# EAGLE design arduino_mega_2 (EAGLE 6.2)
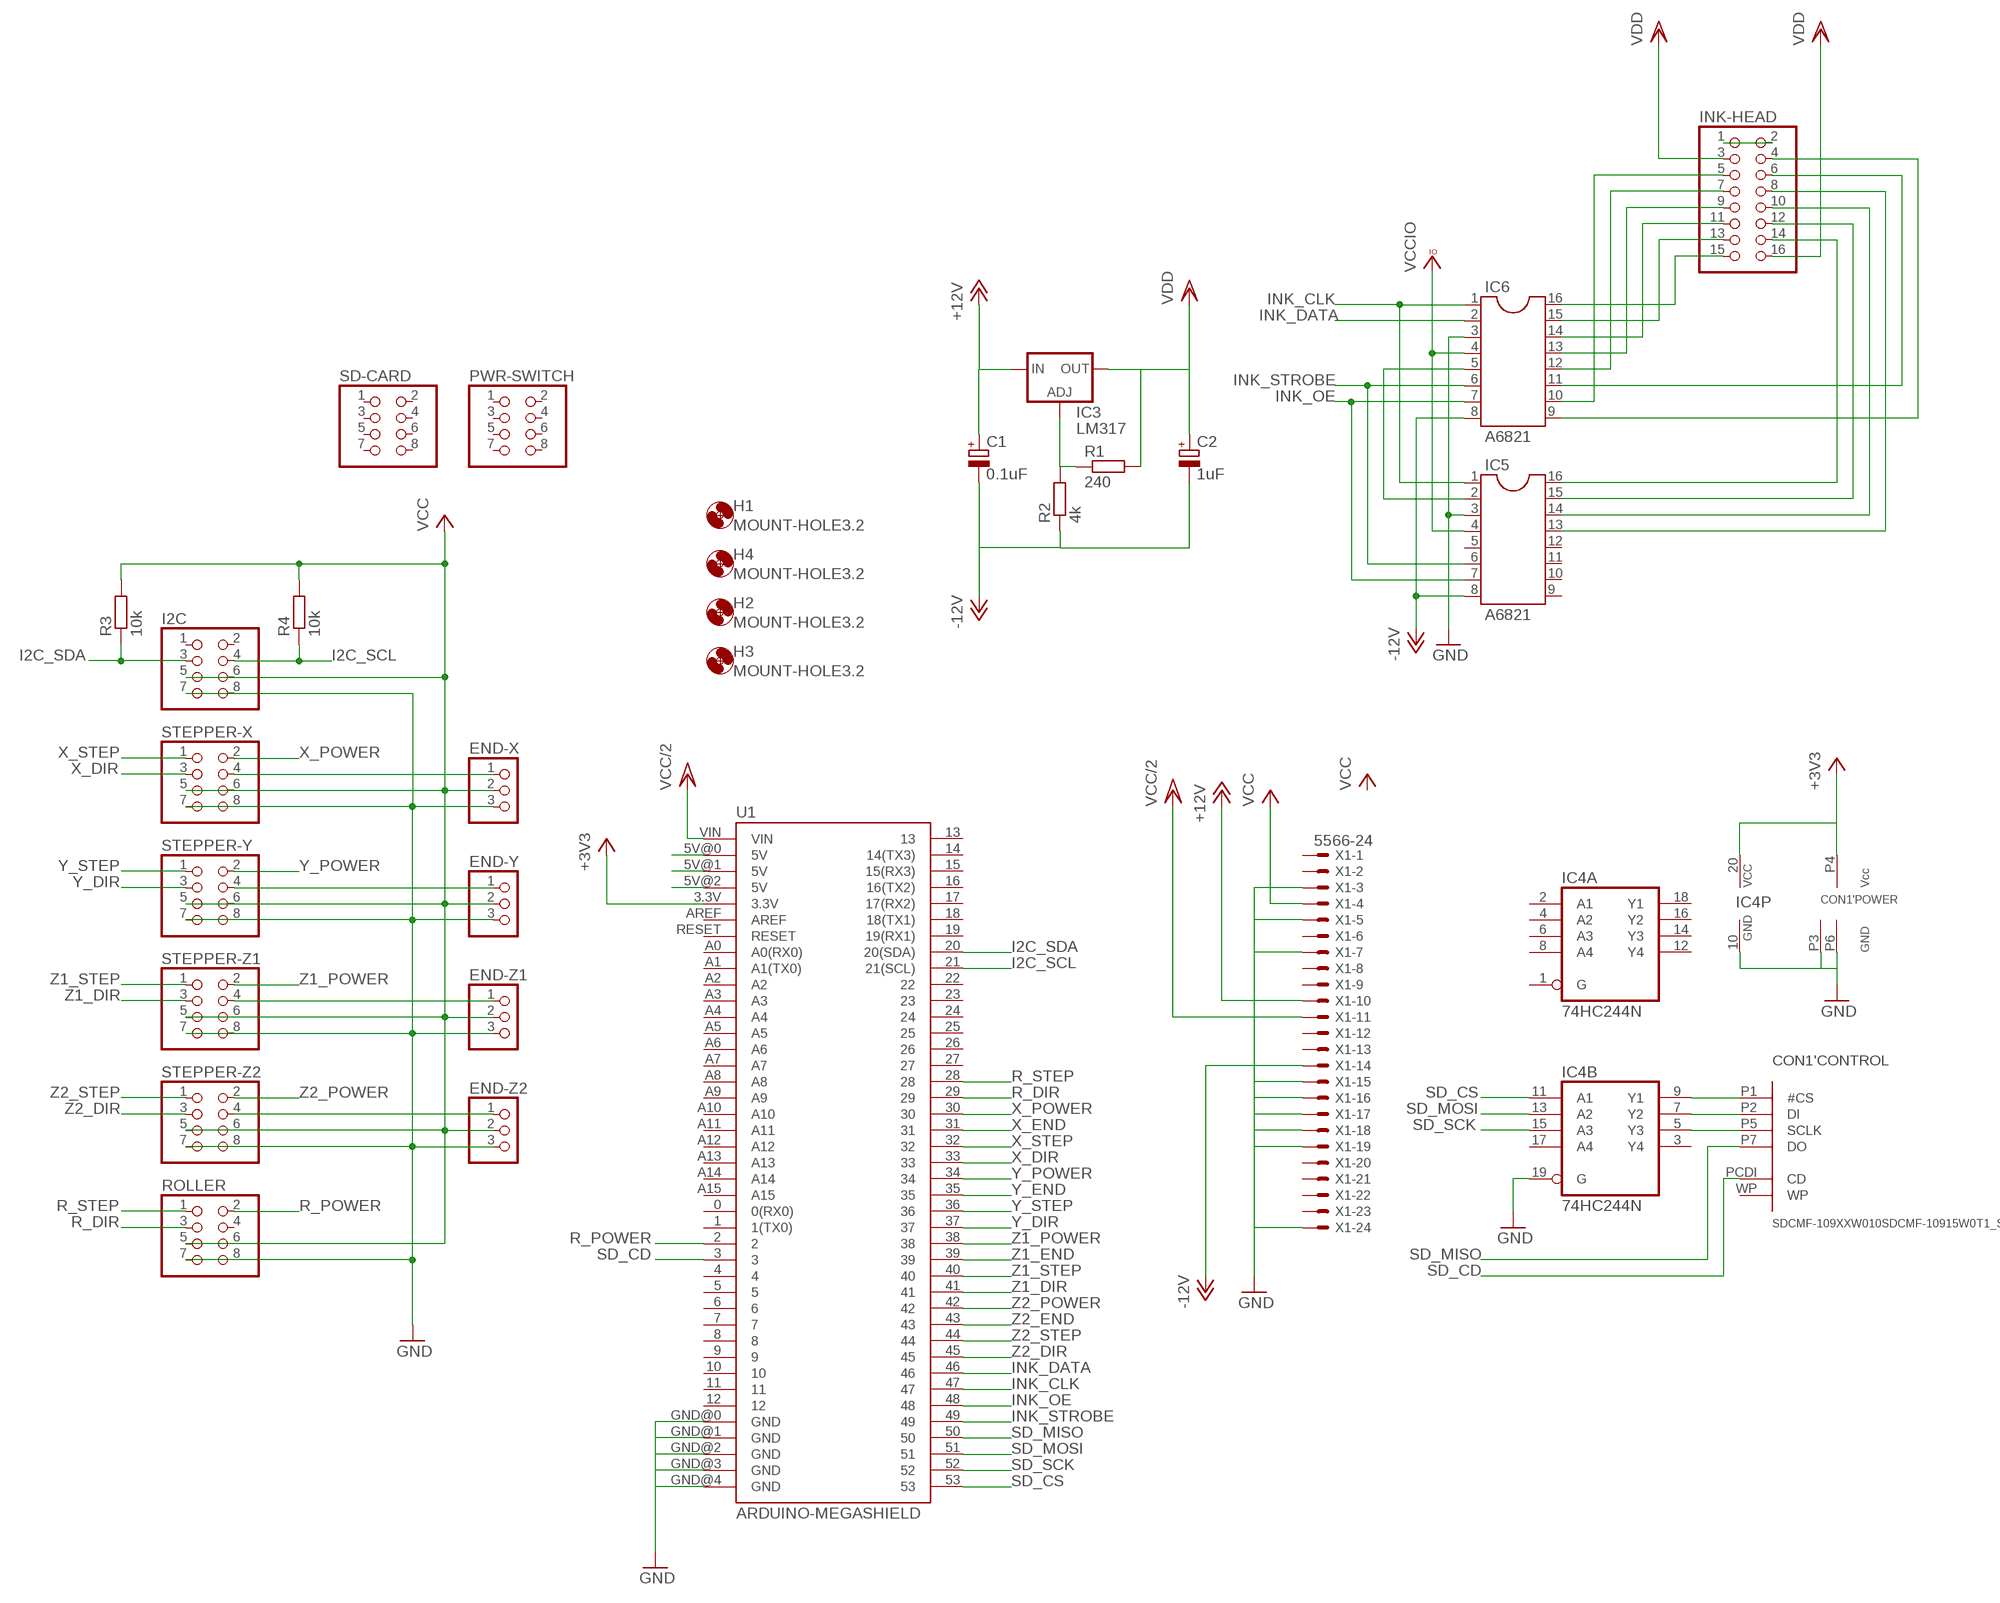
[diagram p0: schematic, sheet 1]

## Parts
C1  0.1uF  CPOL-EUE2-5  [E2-5]
C2  1uF  CPOL-EUE2-5  [E2-5]
CON1  SDCMF-109XXW010SDCMF-10915W0T1_SO  [SDCMF-10915W0T1]
END-X  PINHD-1X3  [1X03]
END-Y  PINHD-1X3  [1X03]
END-Z1  PINHD-1X3  [1X03]
END-Z2  PINHD-1X3  [1X03]
H1  MOUNT-HOLE3.2  [3,2]
H2  MOUNT-HOLE3.2  [3,2]
H3  MOUNT-HOLE3.2  [3,2]
H4  MOUNT-HOLE3.2  [3,2]
I2C  PINHD-2X4  [2X04]
IC3  LM317  LM317TL  [317TL]
IC4  74HC244N  [DIL20]
IC5  A6821  DIL16  [DIL16]
IC6  A6821  DIL16  [DIL16]
INK-HEAD  PINHD-2X8  [2X08]
PWR-SWITCH  PINHD-2X4  [2X04]
R1  240  R-EU_0207/10  [0207/10]
R2  4k  R-EU_0207/10  [0207/10]
R3  10k  R-EU_0204/7  [0204/7]
R4  10k  R-EU_0204/7  [0204/7]
ROLLER  PINHD-2X4  [2X04]
SD-CARD  PINHD-2X4  [2X04]
STEPPER-X  PINHD-2X4  [2X04]
STEPPER-Y  PINHD-2X4  [2X04]
STEPPER-Z1  PINHD-2X4  [2X04]
STEPPER-Z2  PINHD-2X4  [2X04]
U1  ARDUINO-MEGASHIELD  [ARDUINO_MEGA_SHIELD]
X1  5566-24  [5566-24]

## Nets
+3V3: CON1.P4('POWER:VCC) IC4.20(P:VCC) U1.3.3V
+12V: C1.+ IC3.3(IN) X1.10
-12V: C1.- C2.- IC5.8 IC6.8 R2.1 X1.14
GND: CON1.P3('POWER:GND) CON1.P6('POWER:GND) END-X.3 END-Y.3 END-Z1.3 END-Z2.3 I2C.7 I2C.8 IC4.10(P:GND) IC4.19(B:G) IC5.3 IC6.3 ROLLER.7 ROLLER.8 STEPPER-X.7 STEPPER-X.8 STEPPER-Y.7 STEPPER-Y.8 STEPPER-Z1.7 STEPPER-Z1.8 STEPPER-Z2.7 STEPPER-Z2.8 U1.GND@0(GND) U1.GND@1(GND) U1.GND@2(GND) U1.GND@3(GND) U1.GND@4(GND) X1.3 X1.5 X1.7 X1.15 X1.16 X1.17 X1.18 X1.19 X1.24
I2C_SCL: I2C.4 R4.1 U1.21(21(SCL))
I2C_SDA: I2C.3 R3.1 U1.20(20(SDA))
INK_CLK: IC5.1 IC6.1 U1.47
INK_DATA: IC6.2 U1.46
INK_OE: IC5.7 IC6.7 U1.48
INK_STROBE: IC5.6 IC6.6 U1.49
N$1: CON1.P1('CONTROL:#CS) IC4.9(B:Y1)
N$2: CON1.P5('CONTROL:SCLK) IC4.5(B:Y3)
N$3: CON1.P2('CONTROL:DI) IC4.7(B:Y2)
N$4: INK-HEAD.1 INK-HEAD.2
N$5: IC5.16 INK-HEAD.14
N$6: IC5.15 INK-HEAD.12
N$7: IC5.14 INK-HEAD.10
N$8: IC5.13 INK-HEAD.8
N$9: IC6.11 INK-HEAD.6
N$10: IC6.9 INK-HEAD.4
N$11: IC6.16 INK-HEAD.15
N$12: IC6.15 INK-HEAD.13
N$13: IC6.14 INK-HEAD.11
N$14: IC6.13 INK-HEAD.9
N$15: IC6.12 INK-HEAD.7
N$16: IC6.10 INK-HEAD.5
N$17: IC5.2 IC6.5
N$19: IC3.1(ADJ) R1.1 R2.2
R_DIR: ROLLER.3 U1.29
R_POWER: ROLLER.2 U1.2
R_STEP: ROLLER.1 U1.28
SD_CD: CON1.PCDI('CONTROL:CD) U1.3
SD_CS: IC4.11(B:A1) U1.53
SD_MISO: CON1.P7('CONTROL:DO) U1.50
SD_MOSI: IC4.13(B:A2) U1.51
SD_SCK: IC4.15(B:A3) U1.52
VCC: END-X.2 END-Y.2 END-Z1.2 END-Z2.2 I2C.5 I2C.6 R3.2 R4.2 ROLLER.5 ROLLER.6 STEPPER-X.5 STEPPER-X.6 STEPPER-Y.5 STEPPER-Y.6 STEPPER-Z1.5 STEPPER-Z1.6 STEPPER-Z2.5 STEPPER-Z2.6 X1.4
VCC/2: U1.VIN X1.11
VCCIO: IC5.4 IC6.4 U1.5V@0(5V) U1.5V@1(5V) U1.5V@2(5V)
VDD: C2.+ IC3.2(OUT) INK-HEAD.3 INK-HEAD.16 R1.2
X_DIR: STEPPER-X.3 U1.33
X_END: END-X.1 STEPPER-X.4 U1.31
X_POWER: STEPPER-X.2 U1.30
X_STEP: STEPPER-X.1 U1.32
Y_DIR: STEPPER-Y.3 U1.37
Y_END: END-Y.1 STEPPER-Y.4 U1.35
Y_POWER: STEPPER-Y.2 U1.34
Y_STEP: STEPPER-Y.1 U1.36
Z1_DIR: STEPPER-Z1.3 U1.41
Z1_END: END-Z1.1 STEPPER-Z1.4 U1.39
Z1_POWER: STEPPER-Z1.2 U1.38
Z1_STEP: STEPPER-Z1.1 U1.40
Z2_DIR: STEPPER-Z2.3 U1.45
Z2_END: END-Z2.1 STEPPER-Z2.4 U1.43
Z2_POWER: STEPPER-Z2.2 U1.42
Z2_STEP: STEPPER-Z2.1 U1.44
Unconnected: CON1.WP('CONTROL:WP) I2C.1 I2C.2 IC4.1(A:G) IC4.2(A:A1) IC4.3(B:Y4) IC4.4(A:A2) IC4.6(A:A3) IC4.8(A:A4) IC4.12(A:Y4) IC4.14(A:Y3) IC4.16(A:Y2) IC4.17(B:A4) IC4.18(A:Y1) IC5.5 IC5.9 IC5.10 IC5.11 IC5.12 PWR-SWITCH.1 PWR-SWITCH.2 PWR-SWITCH.3 PWR-SWITCH.4 PWR-SWITCH.5 PWR-SWITCH.6 PWR-SWITCH.7 PWR-SWITCH.8 ROLLER.4 SD-CARD.1 SD-CARD.2 SD-CARD.3 SD-CARD.4 SD-CARD.5 SD-CARD.6 SD-CARD.7 SD-CARD.8 U1.0(0(RX0)) U1.1(1(TX0)) U1.4 U1.5 U1.6 U1.7 U1.8 U1.9 U1.10 U1.11 U1.12 U1.13 U1.14(14(TX3)) U1.15(15(RX3)) U1.16(16(TX2)) U1.17(17(RX2)) U1.18(18(TX1)) U1.19(19(RX1)) U1.22 U1.23 U1.24 U1.25 U1.26 U1.27 U1.A0(A0(RX0)) U1.A1(A1(TX0)) U1.A2 U1.A3 U1.A4 U1.A5 U1.A6 U1.A7 U1.A8 U1.A9 U1.A10 U1.A11 U1.A12 U1.A13 U1.A14 U1.A15 U1.AREF U1.RESET X1.1 X1.2 X1.6 X1.8 X1.9 X1.12 X1.13 X1.20 X1.21 X1.22 X1.23

## Library data of the parts
C1 C2 = resistor:CPOL-EU: POLARIZED CAPACITOR, European symbol
CON1 = card_adapters:SDCMF-109XXW010: KingFont SD-CARD SDCMF-109XXW010 SPI -MODE
END-X END-Y END-Z1 END-Z2 = pinhead:PINHD-1X3: PIN HEADER
H1-H4 = holes:MOUNT-HOLE: MOUNTING HOLE with drill center marker
I2C PWR-SWITCH ROLLER SD-CARD STEPPER-X STEPPER-Y STEPPER-Z1 STEPPER-Z2 = pinhead:PINHD-2X4: PIN HEADER
IC3 = v-reg:LM317TL: VOLTAGE REGULATOR
IC4 = 74xx-eu:74*244: Octal BUFFER and LINE DRIVER, 3-state
IC5 IC6 = ic-package:DIL16: Dual In Line / Socket
INK-HEAD = pinhead:PINHD-2X8: PIN HEADER
R1-R4 = resistor:R-EU_: RESISTOR, European symbol
U1 = SparkFun-Boards:ARDUINO-MEGA: Arduino Mega board footprint
X1 = con-molex:5566-24: Mini FIT connector 24 pol Source: http://www.molex.com; OC_FARNELL: unknown; OC_NEWARK: unknown

## Board
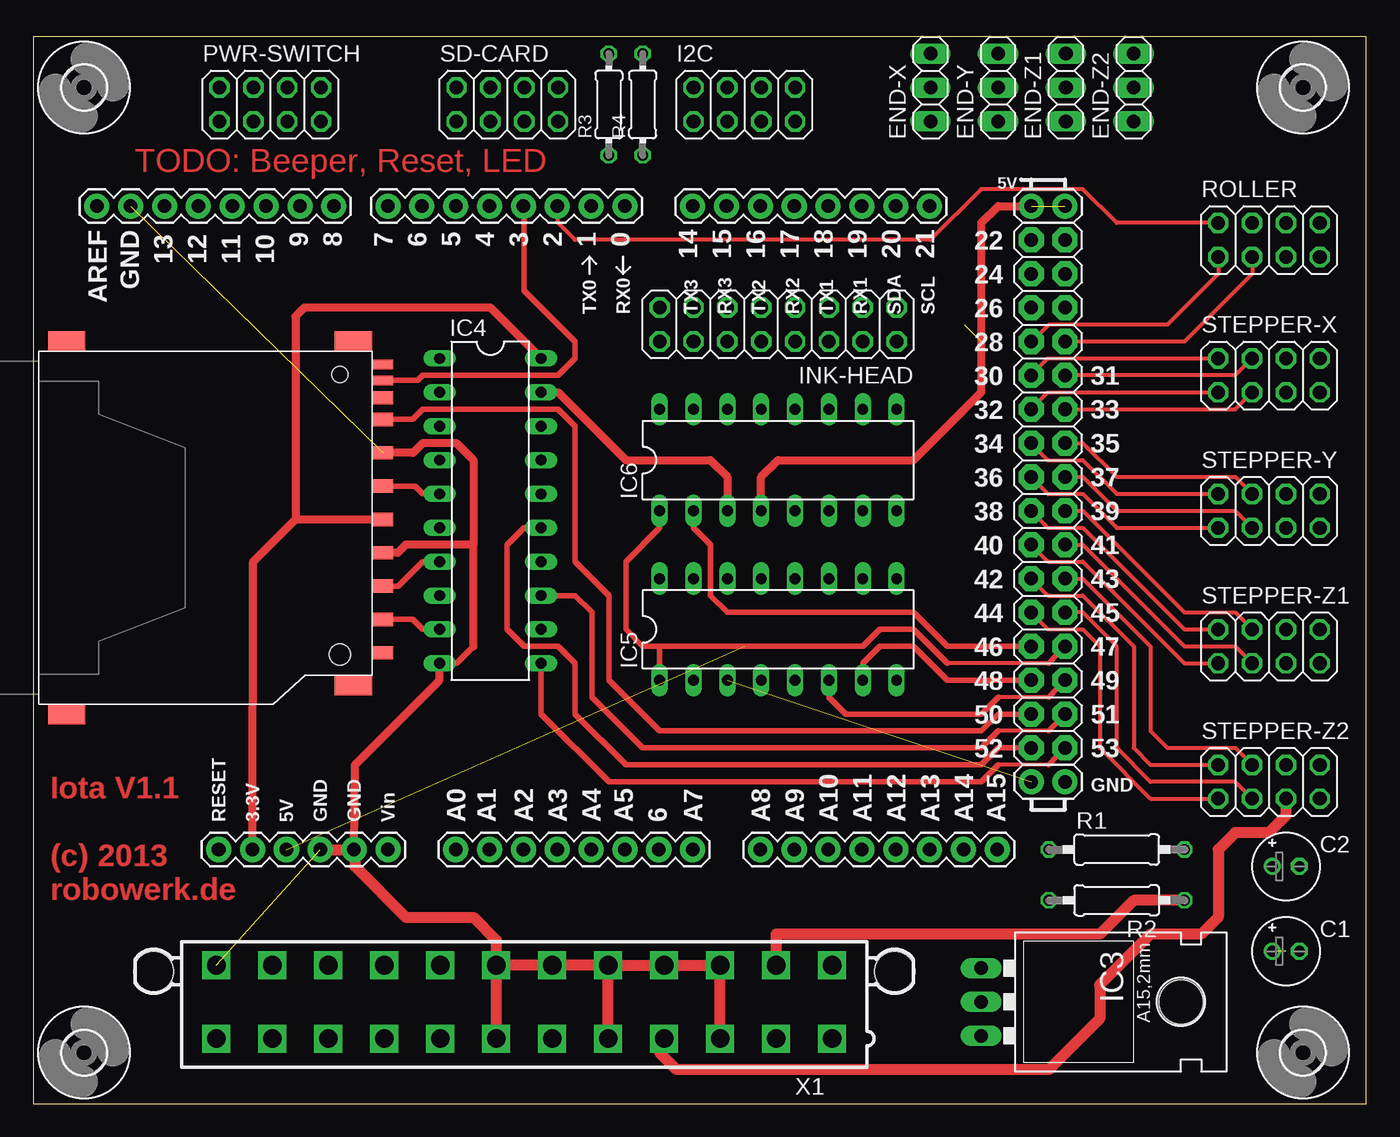
[diagram p1: board, top side]
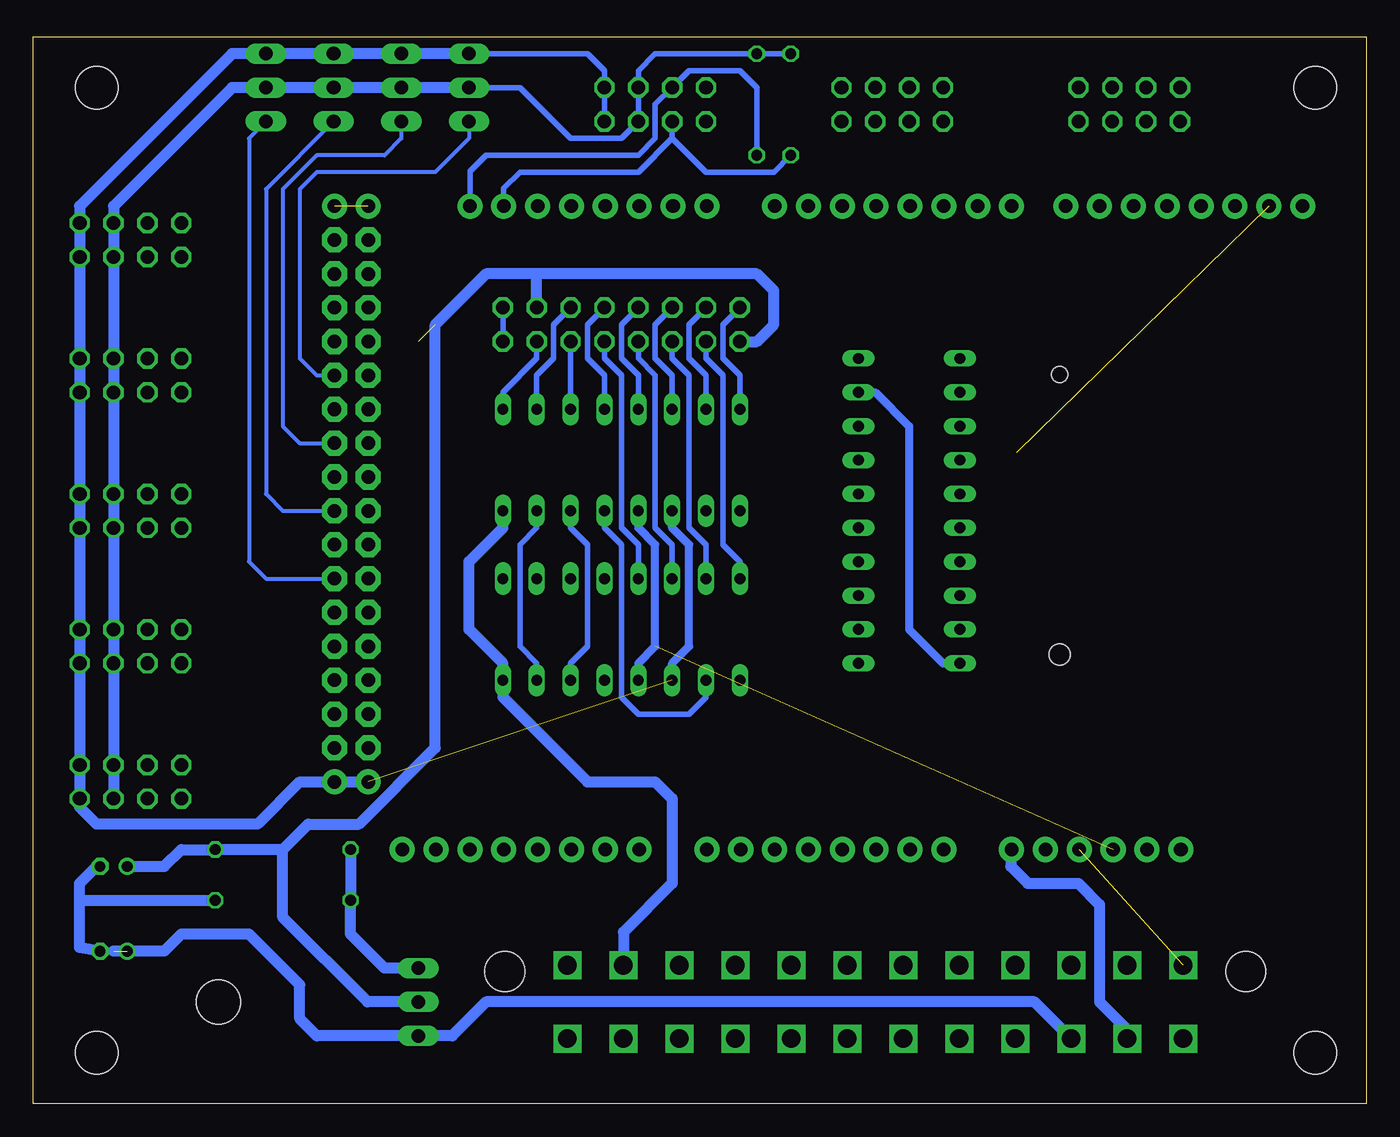
[diagram p2: board, bottom side, seen from below]

Size 100 x 80 mm. Coordinates in mm from the lower left corner, seen from the top.
Outline: 0,0 100,0 100,80 0,80 0,0
Copper layers (1*16): Top 0.035mm / dielectric 1.5mm / Bottom 0.035mm
Design rules: minimum track width 0.15mm, minimum drill 0.3mm, track to track 0.15mm, track to pad 0.15mm, pad to pad 0.15mm, via to via 0.15mm, smd to smd 0mil, copper to edge 0.2mm, drill to drill 0.2mm, minimum pad ring 0.2mm, minimum via ring 0.2mm, stop-mask expansion 4mil, vias tented up to drill 0.8mm, thermal gap 0.15mm

### Footprints (pad centres in the part's own frame; a part is rotated, then mirrored left to right if it is on the bottom)
E2-5 = drill 0.813 pad 1.27: + -1.016,0 | drill 0.813 pad 1.27 octagon: - 1.016,0
SDCMF-10915W0T1 = smd 1.5 x 2.8: F1 -14,-1.4; F2 11.8,-1.4; F3 -14,-22.9; F4 14,-22.9 | smd 1 x 1.5: P1 6.875,0.85; P2 4.375,0.85; P3 1.875,0.85; P4 -0.625,0.85; P5 -3.125,0.85; P6 -5.625,0.85; P7 -8.125,0.85; P8 -9.75,0.85; P9 9.375,0.85 | smd 0.7 x 1.5: PCDI -11.05,0.85; WP -12.25,0.85 | hole 1.6: 9.5,-2.4 | hole 1.2: -11.5,-2.4
1X03 = drill 1.016 long: 1 -2.54,0; 2 0,0; 3 2.54,0
3,2 = hole 3.2: 0,0
2X04 = drill 1.016 octagon: 1 -3.81,-1.27; 2 -3.81,1.27; 3 -1.27,-1.27; 4 -1.27,1.27; 5 1.27,-1.27; 6 1.27,1.27; 7 3.81,-1.27; 8 3.81,1.27
317TL = drill 1.016 long: 1 -2.54,-3.81; 2 0,-3.81; 3 2.54,-3.81 | hole 3.302: 0,11.176
DIL20 = drill 0.813 long: 1 -11.43,-3.81; 2 -8.89,-3.81; 3 -6.35,-3.81; 4 -3.81,-3.81; 5 -1.27,-3.81; 6 1.27,-3.81; 7 3.81,-3.81; 8 6.35,-3.81; 9 8.89,-3.81; 10 11.43,-3.81; 11 11.43,3.81; 12 8.89,3.81; 13 6.35,3.81; 14 3.81,3.81; 15 1.27,3.81; 16 -1.27,3.81; 17 -3.81,3.81; 18 -6.35,3.81; 19 -8.89,3.81; 20 -11.43,3.81
DIL16 = drill 0.813 long: 1 -8.89,-3.81; 2 -6.35,-3.81; 3 -3.81,-3.81; 4 -1.27,-3.81; 5 1.27,-3.81; 6 3.81,-3.81; 7 6.35,-3.81; 8 8.89,-3.81; 9 8.89,3.81; 10 6.35,3.81; 11 3.81,3.81; 12 1.27,3.81; 13 -1.27,3.81; 14 -3.81,3.81; 15 -6.35,3.81; 16 -8.89,3.81
2X08 = drill 1.016 octagon: 1 -8.89,-1.27; 2 -8.89,1.27; 3 -6.35,-1.27; 4 -6.35,1.27; 5 -3.81,-1.27; 6 -3.81,1.27; 7 -1.27,-1.27; 8 -1.27,1.27; 9 1.27,-1.27; 10 1.27,1.27; 11 3.81,-1.27; 12 3.81,1.27; 13 6.35,-1.27; 14 6.35,1.27; 15 8.89,-1.27; 16 8.89,1.27
0207/10 = drill 0.813 octagon: 1 -5.08,0; 2 5.08,0
0204/7 = drill 0.813 octagon: 1 -3.81,0; 2 3.81,0
ARDUINO_MEGA_SHIELD = drill 1.016 pad 1.88: 0 12.7,24.13; 1 10.16,24.13; 2 7.62,24.13; 3 5.08,24.13; 3.3V -15.24,-24.13; 4 2.54,24.13; 5 0,24.13; 5V@0 -12.7,-24.13; 5V@1 43.18,24.13; 5V@2 45.72,24.13; 6 -2.54,24.13; 7 -5.08,24.13; 8 -9.144,24.13; 9 -11.684,24.13; 10 -14.224,24.13; 11 -16.764,24.13; 12 -19.304,24.13; 13 -21.844,24.13; 14 17.78,24.13; 15 20.32,24.13; 16 22.86,24.13; 17 25.4,24.13; 18 27.94,24.13; 19 30.48,24.13; 20 33.02,24.13; 21 35.56,24.13; A0 0,-24.13; A1 2.54,-24.13; A2 5.08,-24.13; A3 7.62,-24.13; A4 10.16,-24.13; A5 12.7,-24.13; A6 15.24,-24.13; A7 17.78,-24.13; A8 22.86,-24.13; A9 25.4,-24.13; A10 27.94,-24.13; A11 30.48,-24.13; A12 33.02,-24.13; A13 35.56,-24.13; A14 38.1,-24.13; A15 40.64,-24.13; AREF -26.924,24.13; GND@0 -10.16,-24.13; GND@1 -7.62,-24.13; GND@2 43.18,-19.05; GND@3 45.72,-19.05; GND@4 -24.384,24.13; RESET -17.78,-24.13; VIN -5.08,-24.13 | drill 1.016 pad 1.88 octagon: 22 43.18,21.59; 23 45.72,21.59; 24 43.18,19.05; 25 45.72,19.05; 26 43.18,16.51; 27 45.72,16.51; 28 43.18,13.97; 29 45.72,13.97; 30 43.18,11.43; 31 45.72,11.43; 32 43.18,8.89; 33 45.72,8.89; 34 43.18,6.35; 35 45.72,6.35; 36 43.18,3.81; 37 45.72,3.81; 38 43.18,1.27; 39 45.72,1.27; 40 43.18,-1.27; 41 45.72,-1.27; 42 43.18,-3.81; 43 45.72,-3.81; 44 43.18,-6.35; 45 45.72,-6.35; 46 43.18,-8.89; 47 45.72,-8.89; 48 43.18,-11.43; 49 45.72,-11.43; 50 43.18,-13.97; 51 45.72,-13.97; 52 43.18,-16.51; 53 45.72,-16.51
5566-24 = drill 1.4 square: 1 23.1,-2.75; 2 18.9,-2.75; 3 14.7,-2.75; 4 10.5,-2.75; 5 6.3,-2.75; 6 2.1,-2.75; 7 -2.1,-2.75; 8 -6.3,-2.75; 9 -10.5,-2.75; 10 -14.7,-2.75; 11 -18.9,-2.75; 12 -23.1,-2.75; 13 23.1,2.75; 14 18.9,2.75; 15 14.7,2.75; 16 10.5,2.75; 17 6.3,2.75; 18 2.1,2.75; 19 -2.1,2.75; 20 -6.3,2.75; 21 -10.5,2.75; 22 -14.7,2.75; 23 -18.9,2.75; 24 -23.1,2.75 | hole 3: 27.8,2.29; -27.8,2.29

### Placement (x,y rotation side)
C1  93.98,11.43 0 top
C2  93.98,17.78 0 top
CON1  25.4,43.18 270 top
END-X  67.31,76.2 90 top
END-Y  72.39,76.2 90 top
END-Z1  77.47,76.2 90 top
END-Z2  82.55,76.2 90 top
H1  3.81,76.2 0 top
H2  95.25,76.2 0 top
H3  3.81,3.81 0 top
H4  95.25,3.81 0 top
I2C  53.34,74.93 0 top
IC3  74.93,7.62 270 top
IC4  34.29,44.45 270 top
IC5  55.88,35.56 0 top
IC6  55.88,48.26 0 top
INK-HEAD  55.88,58.42 180 top
PWR-SWITCH  17.78,74.93 0 top
R1  81.28,19.05 0 top
R2  81.28,15.24 180 top
R3  43.18,74.93 90 top
R4  45.72,74.93 90 top
ROLLER  92.71,64.77 0 top
SD-CARD  35.56,74.93 0 top
STEPPER-X  92.71,54.61 0 top
STEPPER-Y  92.71,44.45 0 top
STEPPER-Z1  92.71,34.29 0 top
STEPPER-Z2  92.71,24.13 0 top
U1  31.69,43.18 0 top
X1  36.83,7.62 0 top

### Tracks (layer width: path | path; a pad name or v marks a point on that pad's centre or on a via)
+3V3
  Top 0.61: U1.3.3V 16.51,40.64 19.68,43.8 | 19.68,43.8 CON1.P4 | IC4.20 34.29,59.69 20.32,59.69 19.68,59.05 19.68,43.8
+12V  (1 unrouted)
  Bottom 0.813: X1.10 24.88,7.62 66.04,7.62 68.58,5.08 IC3.3 78.74,5.08 80.01,6.35 80.01,8.89 83.82,12.7 88.9,12.7 90.17,11.43 93.98,11.43
-12V
  Top 0.813: R2.1 82.55,15.24 80.01,12.7 55.73,12.7 X1.14
  Bottom 0.813: IC6.8 64.77,43.18 67.31,40.64 67.31,35.56 64.77,33.02 IC5.8 64.77,30.48 58.42,24.13 53.34,24.13 52.07,22.86 52.07,16.51 55.73,12.85 X1.14 | 96.52,15.24 96.52,16.51 95.25,17.78 C2.- | C1.- 96.52,11.68 96.52,15.24 | 96.52,15.24 R2.1
GND  (3 unrouted)
  Top 0.406: IC4.10 31.75,33.02 33.02,34.29
  Top 0.61: 33.02,34.29 33.02,41.91 | CON1.P6 28.48,48.8 29.21,49.53 31.75,49.53 33.02,48.26 33.02,41.91 | 33.02,41.91 27.94,41.91 27.34,41.3 CON1.P3 | U1.GND@1 24.13,25.4 30.48,31.75 IC4.10 | IC4.19 39.37,53.34 44.45,48.26 50.8,48.26 52.07,46.99 IC6.3
  Top 0.813: U1.GND@0 U1.GND@1 24.13,17.78 27.94,13.97 33.02,13.97 34.73,12.26 X1.19 | X1.3 X1.15 X1.16 X1.17 | X1.5 X1.17 | X1.17 X1.18 X1.19 | X1.19 X1.7
  Bottom 0.406: END-X.3 58.42,78.74 57.15,77.47 I2C.8 I2C.7
  Bottom 0.61: IC5.3 52.07,33.02 50.8,34.29 50.8,41.91 52.07,43.18 IC6.3 | IC4.19 36.83,53.34 34.29,50.8 34.29,35.56 31.75,33.02 IC4.10
  Bottom 0.813: END-X.3 END-Y.3 END-Z1.3 END-Z2.3 85.09,78.74 96.52,67.31 ROLLER.8 ROLLER.7 STEPPER-X.8 STEPPER-X.7 STEPPER-Y.8 STEPPER-Y.7 STEPPER-Z1.8 STEPPER-Z1.7 STEPPER-Z2.8 STEPPER-Z2.7 96.52,22.23 95.25,20.95 83.19,20.95 80.01,24.13 U1.GND@3 U1.GND@2
I2C_SCL
  Bottom 0.406: U1.21 67.25,69.91 66.04,71.12 54.61,71.12 53.34,72.39 53.34,74.93 I2C.4 50.8,77.47 46.99,77.47 45.72,76.2 R4.1
I2C_SDA
  Bottom 0.406: U1.20 64.71,68.64 63.5,69.85 54.61,69.85 52.07,72.39 | 52.07,72.39 I2C.3 | R3.1 44.45,69.85 49.53,69.85 52.07,72.39
INK_CLK
  Top 0.305: 76.2,33.02 68.58,33.02
  Top 0.406: U1.47 76.2,33.02 | 68.58,33.02 66.04,35.56 63.5,35.56 62.23,34.29 46.99,34.29 | IC6.1 46.99,43.18 44.45,40.64 44.45,35.56 45.72,34.29 46.99,34.29 | 46.99,34.29 IC5.1
INK_DATA
  Top 0.406: U1.46 68.58,34.29 66.04,36.83 52.07,36.83 50.8,38.1 50.8,41.91 49.53,43.18 IC6.2
INK_OE
  Top 0.406: U1.48 68.58,31.75 66.04,34.29 63.5,34.29 62.23,33.02 IC5.7
  Bottom 0.406: IC5.7 62.23,33.02 63.5,34.29 63.5,41.91 62.23,43.18 IC6.7
INK_STROBE
  Top 0.305: 76.2,30.48 72.39,30.48
  Top 0.406: U1.49 76.2,30.48 | 72.39,30.48 71.12,29.21 60.96,29.21 59.69,30.48 IC5.6
  Bottom 0.406: IC5.6 59.69,33.02 58.42,34.29 58.42,41.91 59.69,43.18 IC6.6
N$1
  Top 0.406: IC4.9 29.21,35.56 28.46,36.3 CON1.P1
N$2
  Top 0.406: IC4.5 29.21,45.72 28.62,46.3 CON1.P5
N$3
  Top 0.406: IC4.7 29.21,40.64 27.38,38.8 CON1.P2
N$4
  Bottom 0.406: INK-HEAD.1 INK-HEAD.2
N$5
  Bottom 0.406: IC5.16 46.99,40.64 48.26,41.91 48.26,54.61 49.53,55.88 INK-HEAD.14
N$6
  Bottom 0.406: IC5.15 49.53,41.91 50.8,43.18 50.8,54.61 52.07,55.88 INK-HEAD.12
N$7
  Bottom 0.406: IC5.14 52.07,41.91 53.34,43.18 53.34,54.61 54.61,55.88 INK-HEAD.10
N$8
  Bottom 0.406: IC5.13 54.61,41.91 55.88,43.18 55.88,54.61 57.15,55.88 INK-HEAD.8
N$9
  Bottom 0.406: IC6.11 INK-HEAD.6
N$10
  Bottom 0.406: IC6.9 64.77,53.34 62.23,55.88 INK-HEAD.4
N$11
  Bottom 0.406: IC6.16 46.99,54.61 48.26,55.88 48.26,58.42 INK-HEAD.15
N$12
  Bottom 0.406: IC6.15 49.53,54.61 50.8,55.88 50.8,58.42 INK-HEAD.13
N$13
  Bottom 0.406: IC6.14 52.07,54.61 53.34,55.88 53.34,58.42 INK-HEAD.11
N$14
  Bottom 0.406: IC6.13 54.61,54.61 55.88,55.88 55.88,58.42 INK-HEAD.9
N$15
  Bottom 0.406: IC6.12 57.15,54.61 58.42,55.88 58.42,58.42 INK-HEAD.7
N$16
  Bottom 0.406: IC6.10 62.23,54.61 60.96,55.88 60.96,58.42 INK-HEAD.5
N$17
  Bottom 0.406: IC5.2 49.53,30.48 50.8,29.21 54.61,29.21 55.88,30.48 55.88,41.91 57.15,43.18 IC6.5
N$19
  Bottom 0.813: R1.1 R2.2 76.2,12.7 73.66,10.16 IC3.1
R_DIR
  Top 0.305: 77.47,57.15 U1.29 86.36,57.15 91.44,62.23 ROLLER.3
R_POWER
  Top 0.305: ROLLER.2 81.28,66.04 78.74,68.58 71.12,68.58 67.31,64.77 40.64,64.77 39.37,66.04 39.37,67.25 U1.2
R_STEP
  Top 0.305: ROLLER.1 88.9,62.23 85.09,58.42 76.2,58.42 74.93,57.15 U1.28
SD_CD
  Top 0.406: CON1.PCDI 28.83,54.23 29.21,54.61 39.37,54.61 40.64,55.88 40.64,57.15 36.83,60.96 36.83,67.25 U1.3
SD_CS
  Top 0.305: 76.2,25.4 72.39,25.4
  Top 0.406: U1.53 76.2,25.4 | IC4.11 38.1,29.21 43.18,24.13 71.12,24.13 72.39,25.4
SD_MISO
  Top 0.406: CON1.P7 28.45,51.3 29.21,52.07 39.37,52.07 40.64,50.8 40.64,40.64 43.18,38.1 43.18,31.75 46.99,27.94 71.12,27.94 72.39,29.21 U1.50
SD_MOSI
  Top 0.305: 76.2,27.94 72.39,27.94
  Top 0.406: U1.51 76.2,27.94 | IC4.13 40.64,38.1 41.91,36.83 41.91,30.48 45.72,26.67 71.12,26.67 72.39,27.94
SD_SCK
  Top 0.406: IC4.15 36.83,43.18 35.56,41.91 35.56,35.56 36.83,34.29 39.37,34.29 40.64,33.02 40.64,29.21 44.45,25.4 71.12,25.4 72.39,26.67 U1.52
VCC
  Top 0.813: STEPPER-Z2.5 93.98,21.59 92.71,20.32 90.17,20.32 88.9,19.05 88.9,13.97 87.63,12.7 83.82,12.7 80.01,8.89 80.01,6.35 76.2,2.54 48.26,2.54 46.99,3.81 46.99,4.53 X1.4
  Bottom 0.406: END-X.2 63.5,76.2 59.69,72.39 55.88,72.39 I2C.5 I2C.6 54.61,77.47 53.34,78.74 R3.2 R4.2
  Bottom 0.813: END-X.2 END-Y.2 END-Z1.2 END-Z2.2 85.09,76.2 93.98,67.31 ROLLER.6 ROLLER.5 STEPPER-X.6 STEPPER-X.5 STEPPER-Y.6 STEPPER-Y.5 STEPPER-Z1.6 STEPPER-Z1.5 STEPPER-Z2.6 STEPPER-Z2.5
VCC/2
  Bottom 0.813: U1.VIN 26.67,17.78 25.4,16.51 21.59,16.51 20,14.92 20,7.62 17.93,5.55 X1.11
VCCIO  (2 unrouted)
  Top 0.61: IC6.4 54.61,46.99 55.88,48.26 66.04,48.26 71.12,53.34 71.12,66.04 72.39,67.31 U1.5V@1
  Bottom 0.61: IC5.4 54.61,33.02 53.34,34.29 53.34,41.91 54.61,43.18 IC6.4
VDD  (1 unrouted)
  Bottom 0.813: C2.+ 90.17,17.78 88.9,19.05 R1.2 81.28,19.05 | IC3.2 74.93,7.62 81.28,13.97 81.28,19.05 | INK-HEAD.16 45.72,57.15 44.45,58.42 44.45,60.96 45.72,62.23 62.23,62.23 | INK-HEAD.3 62.23,62.23 | 62.23,62.23 66.04,62.23 69.85,58.42 69.85,26.67 75.56,20.95 79.38,20.95 81.28,19.05
X_DIR
  Top 0.305: U1.33 90.17,52.07 STEPPER-X.3
X_END
  Top 0.305: STEPPER-X.4 90.17,54.61 U1.31
  Bottom 0.305: END-X.1 67.31,72.39 69.85,69.85 78.74,69.85 80.01,68.58 80.01,55.88 78.74,54.61 U1.31
X_POWER
  Top 0.305: U1.30 76.14,55.88 STEPPER-X.2
X_STEP
  Top 0.305: U1.32 76.14,53.34 STEPPER-X.1
Y_DIR
  Top 0.305: U1.37 78.74,46.99 81.28,44.45 90.17,44.45 STEPPER-Y.3
Y_END
  Top 0.305: U1.35 78.74,49.53 81.28,46.99 90.17,46.99 STEPPER-Y.4
  Bottom 0.305: END-Y.1 72.39,72.39 73.66,71.12 78.74,71.12 81.28,68.58 81.28,50.8 80.01,49.53 U1.35
Y_POWER
  Top 0.305: U1.34 76.14,48.26 78.74,48.26 81.28,45.72 STEPPER-Y.2
Y_STEP
  Top 0.305: U1.36 76.14,45.72 78.74,45.72 81.28,43.18 STEPPER-Y.1
Z1_DIR
  Top 0.305: U1.41 78.74,41.91 86.36,34.29 90.17,34.29 STEPPER-Z1.3
Z1_END
  Top 0.305: U1.39 78.74,44.45 86.36,36.83 90.17,36.83 STEPPER-Z1.4
  Bottom 0.305: END-Z1.1 82.55,68.58 82.55,45.72 81.28,44.45 U1.39
Z1_POWER
  Top 0.305: U1.38 76.14,43.18 78.74,43.18 86.36,35.56 STEPPER-Z1.2
Z1_STEP
  Top 0.305: U1.40 76.14,40.64 78.74,40.64 86.36,33.02 STEPPER-Z1.1
Z2_DIR
  Top 0.305: STEPPER-Z2.3 90.17,24.13 83.82,24.13 81.28,26.67 81.28,34.29 78.74,36.83 U1.45
Z2_END
  Top 0.305: U1.43 78.74,39.37 83.82,34.29 83.82,27.94 85.09,26.67 90.17,26.67 STEPPER-Z2.4
  Bottom 0.305: END-Z2.1 83.82,72.39 83.82,40.64 82.55,39.37 U1.43
Z2_POWER
  Top 0.305: U1.42 76.14,38.1 78.74,38.1 82.55,34.29 82.55,26.67 83.82,25.4 STEPPER-Z2.2
Z2_STEP
  Top 0.305: U1.44 76.14,35.56 78.74,35.56 80.01,34.29 80.01,26.67 83.82,22.86 STEPPER-Z2.1

### Text on the board
Top: TODO: Beeper, Reset, LED | Iota V1.1 | (c) 2013 | robowerk.de